# Altium schematic sheet LPEDT_revA1_bikeit_GPS_MECH.SchDoc: GPS Mechanical
size A; Author: Dhruva Koley; DocumentNumber: 9; Revision: 1; SheetNumber: 9; SheetTotal: 12
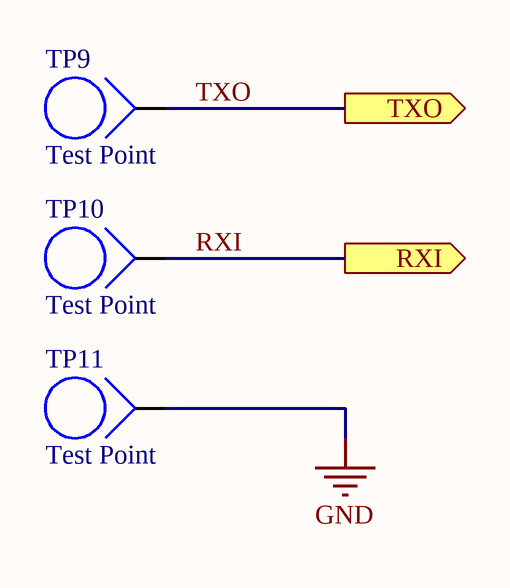
[diagram p0: LPEDT_revA1_bikeit_GPS_MECH.SchDoc]

## Parts
TP9  Test Point
TP10  Test Point
TP11  Test Point

## Ports
RXI (out), TXO (out)

## Nets
GND: TP11.1
RXI: TP10.1 ; port RXI
TXO: TP9.1 ; port TXO

## Library data of the parts
TP9-TP11 = Test Pad